# EAGLE schematic SDI12IB_v0.2 (EAGLE 5.11)
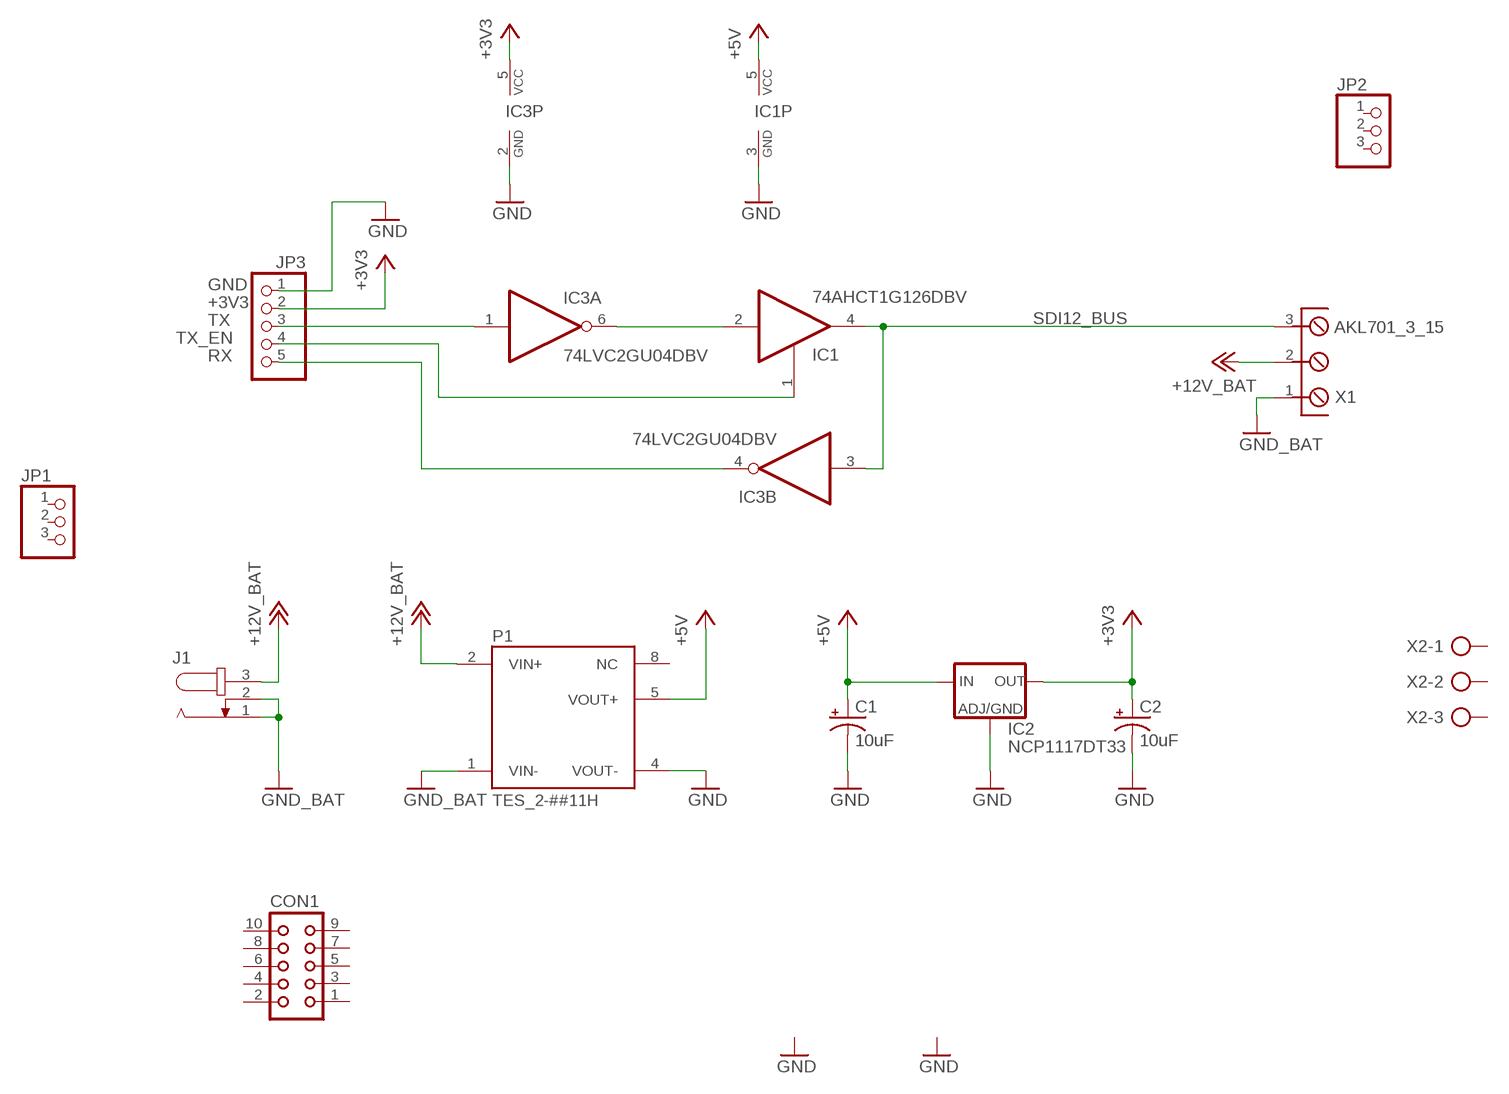
[diagram p0: schematic, sheet 1]

## Parts
C1  10uF  CPOL-USUD-5X5,8  [UD-5X5,8_NICHICON]
C2  10uF  CPOL-USUD-5X5,8  [UD-5X5,8_NICHICON]
CON1  CON10  [CON10]
IC1  74AHCT1G126DBV  [SOT23-5]
IC2  NCP1117DT33  [DPACK]
IC3  74LVC2GU04DBV  [SOT23-6]
J1  JACK-PLUG1  [SPC4078]
JP1  PINHD-1X3  [1X03]
JP2  PINHD-1X3  [1X03]
JP3  PINHD-1X5  [1X05]
P1  TES_2-##11H  [TRACO_SMD_8]
X1  AKL701_3_15  [AKL701_3_15]
X2  AK300/3  [AK300/3]

## Nets
+3V3: C2.+ IC2.4(OUT) IC3.5(P:VCC) JP3.2
+5V: C1.+ IC1.5(VCC) IC2.3(IN) P1.5(VOUT+)
+12V: J1.3 P1.2(VIN+) X1.2 ; supply symbol labelled +12V_BAT
GND: C1.- C2.- IC1.3(GND) IC2.1(ADJ) IC3.2(P:GND) J1.1 J1.2 JP3.1 P1.1(VIN-) P1.4(VOUT-) X1.1 ; supply symbol labelled GND_BAT
N$1: IC1.2(I) IC3.6(A:O)
RX: IC3.4(B:O) JP3.5
SDI12_BUS: IC1.4(O) IC3.3(B:I) X1.3
TX: IC3.1(A:I) JP3.3
TX_EN: IC1.1(OE) JP3.4
Unconnected: CON1.1 CON1.2 CON1.3 CON1.4 CON1.5 CON1.6 CON1.7 CON1.8 CON1.9 CON1.10 JP1.1 JP1.2 JP1.3 JP2.1 JP2.2 JP2.3 P1.8(NC) X2.1 X2.2 X2.3

## Library data of the parts
C1 C2 = rcl:CPOL-US: POLARIZED CAPACITOR, American symbol
CON1 = con-harting:CON10: CONNECTOR; OC_FARNELL: unknown; OC_NEWARK: unknown
IC1 = 74xx-little-us:74*1G126: Single Bus Buffer Gate With 3-State Outputs
IC2 = ipas:NCP1117?*: Low drop-out positive fixed and adjustable voltage regulator
IC3 = ipas:74*2GU04: INVERTER Gate
J1 = con-jack:JACK-PLUG: DC POWER JACK Power Jack, DC, Right Angle, Through Hole, Rated 5A at 16VDC, PC Terminals Distributor: Farnell (www.Farnell.de) Drawing: 84N1161.pdf / 84N1162.pdf Manufacturer: SPC Technology (www.spctechnology.com) Type: SPC4077 / SPC 4078; OC_FARNELL: unknown; OC_NEWARK: unknown
JP1 JP2 = pinhead:PINHD-1X3: PIN HEADER
JP3 = pinhead:PINHD-1X5: PIN HEADER
P1 = ipas:TES_2-##?*: Traco(r) Power TES Single Output Series 2 W DC/DC-Converters, SMD (TES 2-xx1yH) Author: iPAS, ipas@inbox.com Note: Applying supply symbols on VIN pins (defined direction is "Pwr") allows different input voltages with multiple converter devices, if needed) TRACO(r) Ordercode : Input V : Output V TES 2-0510 : 5 : 3.3 TES 2-0511 : 5 : 5.0 TES 2-0512 : 5 : 12 TES 2-1210 : 12 (9..18) : 3.3 TES 2-1211 : 12 (9..18) : 5.0 TES 2-1212 : 12 (9..18) : 12 TES 2-2410 : 24 (18..36) : 3.3 TES 2-2411 : 24 (18..36) : 5.0 TES 2-2412 : 24 (18..36) : 12; VOUT: 2
X1 = _con_riacon_akl701:AKL701_3*: RIACON (Ria Connect) Screw Type Terminal Block Type AKL 701 - 3 (pole-size: 3) centerline 6.35 mm / 0.250 inches, 400 V / 24 A, horizontal wire entry, lift system, modular packages: _13: recommended pcb hole dia. = 1,3 mm _15: pcb hole dia. = 1,5 mm (prototyping) Auhtor: Dipl.-Ing. FH Rainer Bayer, Hochschule Heilbronn (rainer.bayer@hs-heilbronn.de)
X2 = con-ptr500:AK300/3: CONNECTOR; OC_FARNELL: unknown; OC_NEWARK: unknown